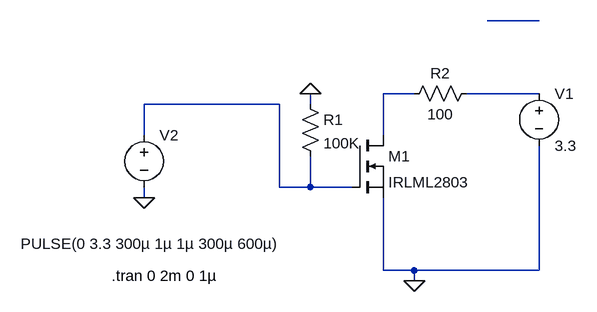
[diagram p0: schematic projekt_mosfet.asc]
projekt_mosfet.asc, the LTspice schematic file:
Version 4
SHEET 1 880 680
WIRE 416 -96 336 -96
WIRE 224 16 176 16
WIRE 416 16 304 16
WIRE 16 32 -192 32
WIRE 64 32 64 16
WIRE -192 80 -192 32
WIRE 176 80 176 16
WIRE 16 160 16 32
WIRE 64 160 64 112
WIRE 64 160 16 160
WIRE 128 160 64 160
WIRE -192 176 -192 160
WIRE 176 288 176 176
WIRE 224 288 176 288
WIRE 416 288 416 96
WIRE 416 288 224 288
WIRE 224 304 224 288
FLAG 224 304 0
FLAG 64 16 0
FLAG -192 176 0
SYMBOL nmos 128 80 R0
SYMATTR InstName M1
SYMATTR Value IRLML2803
SYMBOL res 48 16 R0
SYMATTR InstName R1
SYMATTR Value 100K
SYMATTR SpiceLine tol=1 pwr=0.1
SYMBOL sym_pal\ (1)\\voltage 416 0 R0
SYMATTR InstName V1
SYMATTR Value 3.3
SYMBOL sym_pal\ (1)\\voltage -192 64 R0
WINDOW 3 -190 183 Left 2
WINDOW 123 0 0 Left 2
WINDOW 39 0 0 Left 2
SYMATTR InstName V2
SYMATTR Value PULSE(0 3.3 300µ 1µ 1µ 300µ 600µ)
SYMBOL res 208 32 R270
WINDOW 0 32 56 VTop 2
WINDOW 3 0 56 VBottom 2
SYMATTR InstName R2
SYMATTR Value 100
TEXT -242 296 Left 2 !.tran 0 2m 0 1µ

The netlist it stands for:
* projekt_mosfet.asc
M1 N002 N004 0 0 IRLML2803
R1 0 N004 100K tol=1 pwr=0.1
V1 N003 0 3.3
V2 N004 0 PULSE(0 3.3 300µ 1µ 1µ 300µ 600µ)
R2 N002 N003 100
.model NMOS NMOS
.model PMOS PMOS
.lib standard.mos
.tran 0 2m 0 1µ
.backanno
.end